# Altium schematic sheet CLASS.SchDoc
size A4
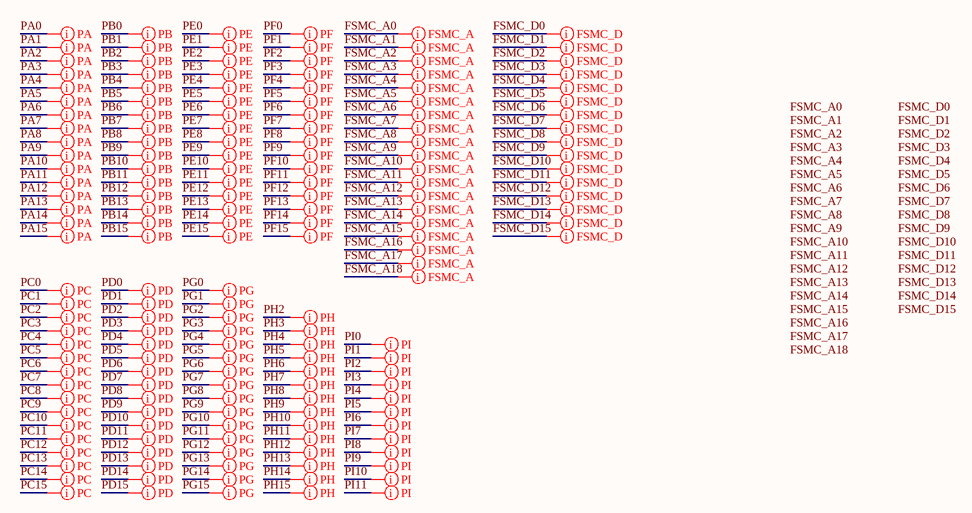
[diagram p0: CLASS.SchDoc]

## Layout directives
net class PA: PA0, PA1, PA2, PA3, PA4, PA5, PA6, PA7, PA8, PA9, PA10, PA11, PA12, PA13, PA14, PA15
net class PC: PC0, PC1, PC2, PC3, PC4, PC5, PC6, PC7, PC8, PC9, PC10, PC11, PC12, PC13, PC14, PC15
net class PB: PB0, PB1, PB2, PB3, PB4, PB5, PB6, PB7, PB8, PB9, PB10, PB11, PB12, PB13, PB14, PB15
net class PE: PE0, PE1, PE2, PE3, PE4, PE5, PE6, PE7, PE8, PE9, PE10, PE11, PE12, PE13, PE14, PE15
net class PF: PF0, PF1, PF2, PF3, PF4, PF5, PF6, PF7, PF8, PF9, PF10, PF11, PF12, PF13, PF14, PF15
net class PD: PD0, PD1, PD2, PD3, PD4, PD5, PD6, PD7, PD8, PD9, PD10, PD11, PD12, PD13, PD14, PD15
net class PG: PG0, PG1, PG2, PG3, PG4, PG5, PG6, PG7, PG8, PG9, PG10, PG11, PG12, PG13, PG14, PG15
net class PH: PH2, PH3, PH4, PH5, PH6, PH7, PH8, PH9, PH10, PH11, PH12, PH13, PH14, PH15
net class FSMC_A: FSMC_A0, FSMC_A1, FSMC_A2, FSMC_A3, FSMC_A4, FSMC_A5, FSMC_A6, FSMC_A7, FSMC_A8, FSMC_A9, FSMC_A10, FSMC_A11, FSMC_A12, FSMC_A13, FSMC_A14, FSMC_A15, FSMC_A16, FSMC_A17, FSMC_A18
net class FSMC_D: FSMC_D0, FSMC_D1, FSMC_D2, FSMC_D3, FSMC_D4, FSMC_D5, FSMC_D6, FSMC_D7, FSMC_D8, FSMC_D9, FSMC_D10, FSMC_D11, FSMC_D12, FSMC_D13, FSMC_D14, FSMC_D15
net class PI: PI0, PI1, PI2, PI3, PI4, PI5, PI6, PI7, PI8, PI9, PI10, PI11

## Notes on the sheet
- Labels drawn without touching a wire or pin: FSMC_A0, FSMC_A1, FSMC_A2, FSMC_A3, FSMC_A4, FSMC_A5, FSMC_A6, FSMC_A7, FSMC_A8, FSMC_A9, FSMC_A10, FSMC_A11, FSMC_A12, FSMC_A13, FSMC_A14, FSMC_A15, FSMC_A16, FSMC_A17, FSMC_A18, FSMC_D0, FSMC_D1, FSMC_D2, FSMC_D3, FSMC_D4, FSMC_D5, FSMC_D6, FSMC_D7, FSMC_D8, FSMC_D9, FSMC_D10, FSMC_D11, FSMC_D12, FSMC_D13, FSMC_D14, FSMC_D15